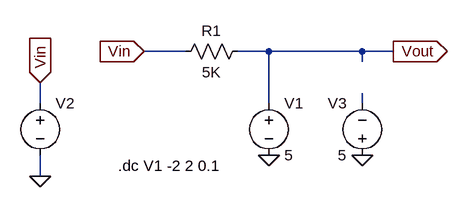
[diagram p0: schematic HW 6 #1a - Case #2.asc]
HW 6 #1a - Case #2.asc, the LTspice schematic file:
Version 4
SHEET 1 880 680
WIRE 80 144 16 144
WIRE 208 144 160 144
WIRE 352 144 208 144
WIRE 400 144 352 144
WIRE 352 160 352 144
WIRE -144 224 -144 192
WIRE 208 224 208 144
WIRE 352 224 352 208
WIRE -144 336 -144 304
FLAG 16 144 Vin
IOPIN 16 144 In
FLAG 400 144 Vout
IOPIN 400 144 Out
FLAG -144 192 Vin
IOPIN -144 192 In
FLAG -144 336 0
FLAG 208 304 0
FLAG 352 304 0
SYMBOL res 176 128 R90
WINDOW 0 0 56 VBottom 2
WINDOW 3 32 56 VTop 2
SYMATTR InstName R1
SYMATTR Value 5K
SYMBOL voltage -144 208 R0
SYMATTR InstName V2
SYMATTR Value ""
SYMBOL voltage 208 208 R0
SYMATTR InstName V1
SYMATTR Value 5
SYMBOL voltage 352 320 R180
WINDOW 0 24 96 Left 2
WINDOW 3 24 16 Left 2
SYMATTR InstName V3
SYMATTR Value 5
TEXT -24 320 Left 2 !.dc V1 -2 2 0.1

The netlist it stands for:
* HW 6 #1a - Case #2.asc
R1 Vout Vin 5K
V2 Vin 0
V1 Vout 0 5
V3 0 N001 5
.dc V1 -2 2 0.1
.backanno
.end

* Results of the author's LTspice run, read from the files saved beside the schematic
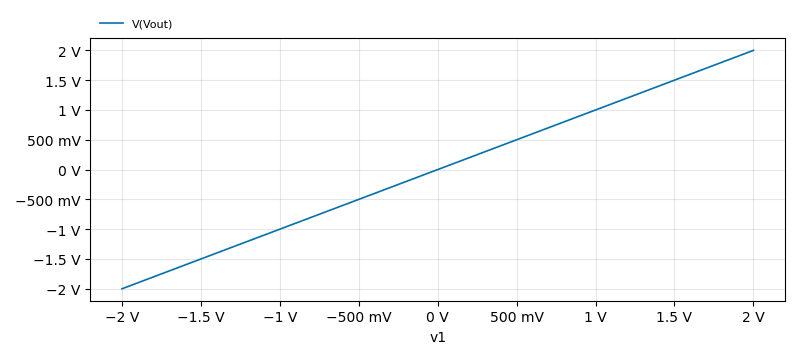
[diagram p1: DC transfer characteristic of HW 6 #1a - Case #2.asc, plotted from the saved traces]
* DC transfer characteristic, 1 run:
*   V(Vout): -2 V at v1=-2 V, 2 V at v1=2 V, min -2 V, max 2 V